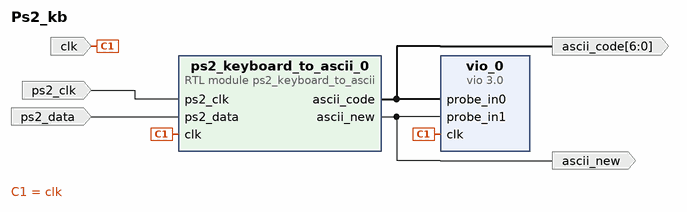
[diagram p0: block diagram of the top level]
# Vivado block design Ps2_kb, xc7a35ticsg324-1L, Vivado 2021.1
create_bd_design Ps2_kb

create_bd_port -dir I -type clk clk
create_bd_port -dir I -type clk ps2_clk
create_bd_port -dir I ps2_data
create_bd_port -dir O -from 6 -to 0 ascii_code
create_bd_port -dir O ascii_new

create_bd_cell -type ip -vlnv xilinx.com:ip:vio:3.0 vio_0
set_property -dict {CONFIG.C_NUM_PROBE_IN 2 CONFIG.C_NUM_PROBE_OUT 0} [get_bd_cells vio_0]
create_bd_cell -type module -reference ps2_keyboard_to_ascii ps2_keyboard_to_ascii_0

# ---- connections ----

connect_bd_net -net clk_0_1 [get_bd_ports clk] [get_bd_pins vio_0/clk] [get_bd_pins ps2_keyboard_to_ascii_0/clk]
connect_bd_net [get_bd_ports ps2_clk] [get_bd_pins ps2_keyboard_to_ascii_0/ps2_clk]
connect_bd_net [get_bd_ports ps2_data] [get_bd_pins ps2_keyboard_to_ascii_0/ps2_data]
connect_bd_net [get_bd_pins ps2_keyboard_to_ascii_0/ascii_code] [get_bd_pins vio_0/probe_in0] [get_bd_ports ascii_code]
connect_bd_net [get_bd_pins ps2_keyboard_to_ascii_0/ascii_new] [get_bd_pins vio_0/probe_in1] [get_bd_ports ascii_new]

validate_bd_design
save_bd_design
